# EAGLE design KTS_ver_001 (EAGLE 7.2.0)
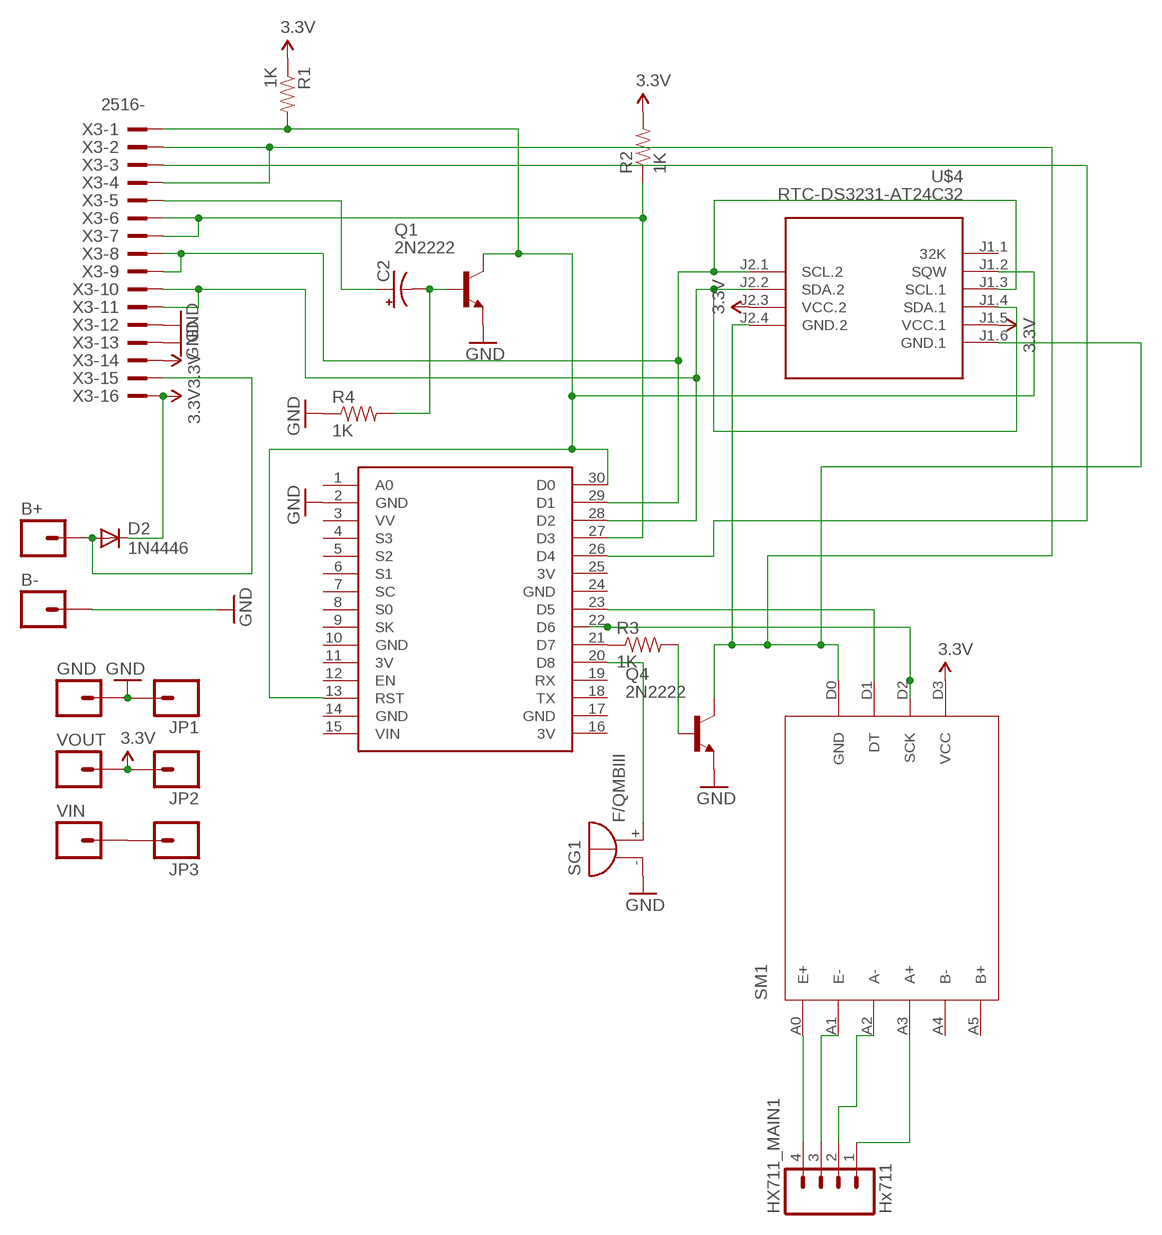
[diagram p0: schematic, sheet 1]

## Parts
B+  M01OFFSET  [1X01_OFFSET]
B-  M01OFFSET  [1X01_OFFSET]
C2  CAP_POLPTH2  [CPOL-RADIAL-10UF-25V]
D2  1N4446  [DO35-10]
GND  M01PTH  [1X01]
HX711_MAIN1  Hx711  M04LOCK  [1X04_LOCK]
JP1  M01PTH  [1X01]
JP2  M01PTH  [1X01]
JP3  M01PTH  [1X01]
Q1  2N2222  [TO18]
Q4  2N2222  [TO18]
R1  1K  1KOHM-1/4W-1%(PTH)  [AXIAL-0.3]
R2  1K  1KOHM-1/4W-1%(PTH)  [AXIAL-0.3]
R3  1K  1KOHM-1/4W-1%(PTH)  [AXIAL-0.3]
R4  1K  1KOHM-1/4W-1%(PTH)  [AXIAL-0.3]
SG1  F/QMBIII  [F/QMBIII]
SM1  HX711  [HX711]
U$3  NODEMCU  [NODEMCU]
U$4  RTC-DS3231-AT24C32  [RTC-DS3231-AT24C32]
VIN  M01PTH  [1X01]
VOUT  M01PTH  [1X01]
X3  2516-  [PAK100/2500-16]

## Nets
3.3V: D2.C JP2.1 R1.P$1 R2.P$2 SM1.D3(VCC) U$4.J1.5(VCC.1) U$4.J2.3(VCC.2) VOUT.1 X3.14 X3.16
BUTTON/D1: U$3.26(D4) X3.3
D7: R3.P$1 U$3.21(D7)
D8/BUZZER1: SG1.+(-) U$3.20(D8)
DS18B20/D1: R2.P$1 U$3.27(D3) X3.6 X3.7
GND: B-.1 GND.1 JP1.1 Q1.1(E) Q4.1(E) R4.P$1 SG1.-(+) U$3.2(GND) X3.12 X3.13
HX711/DT/D5: SM1.D1(DT) U$3.23(D5)
LOADBUS1: Q4.3(C) SM1.D0(GND) U$4.J1.6(GND.1) U$4.J2.4(GND.2) X3.2 X3.4
N$1: B+.1 D2.A X3.15
N$2: C2.2(-) Q1.2(B) R4.P$2
N$4: Q4.2(B) R3.P$2
N$6: JP3.1 VIN.1
N$7: HX711_MAIN1.4 SM1.A0(E+)
N$8: HX711_MAIN1.3 SM1.A1(E-)
N$12: HX711_MAIN1.2 SM1.A2(A-)
N$15: HX711_MAIN1.1 SM1.A3(A+)
RESET_BUS1: Q1.3(C) R1.P$2 U$3.13(RST) U$3.30(D0) U$4.J1.2(SQW) X3.1
SCK/D6/HX711: SM1.D2(SCK) U$3.22(D6)
SCL/D2: U$3.29(D1) U$4.J1.3(SCL.1) U$4.J2.1(SCL.2) X3.8 X3.9
SDA/D1: U$3.28(D2) U$4.J1.4(SDA.1) U$4.J2.2(SDA.2) X3.10 X3.11
SIGNAL(RESET): C2.1(+) X3.5
Unconnected: SM1.A4(B-) SM1.A5(B+) U$3.1(A0) U$3.3(VV) U$3.4(S3) U$3.5(S2) U$3.6(S1) U$3.7(SC) U$3.8(S0) U$3.9(SK) U$3.12(EN) U$3.15(VIN) U$3.18(TX) U$3.19(RX) U$4.J1.1(32K)

## Power pins joined to a net without a drawn wire
3V: U$3.11(3V) U$3.16(3V) U$3.25(3V)
GND: U$3.10(GND) U$3.14(GND) U$3.17(GND) U$3.24(GND)

## Library data of the parts
B+ B- GND JP1-JP3 VIN VOUT = SparkFun-Connectors:M01: Header 1 Standard 1-pin 0.1" header. Use with straight break away headers (SKU : PRT-00116), right angle break away headers (PRT-00553), swiss pins (PRT-00743), machine pins (PRT-00117), and female headers (PRT-00115).
C2 = SparkFun-Capacitors:CAP_POL: Capacitor Polarized These are standard SMD and PTH capacitors. Normally 10uF, 47uF, and 100uF in electrolytic and tantalum varieties. Always verify the external diameter of the through hole cap, it varies with capacity, voltage, and manufacturer. The EIA devices should be standard.
D2 = diode:1N4446: DIODE high speed (Philips)
HX711_MAIN1 = SparkFun-Connectors:M04: Header 4 Standard 4-pin 0.1" header. Use with straight break away headers (SKU : PRT-00116), right angle break away headers (PRT-00553), swiss pins (PRT-00743), machine pins (PRT-00117), and female headers (PRT-00115). Molex polarized connector foot print use with SKU : PRT-08231 with associated crimp pins and housings. 1MM SMD Version SKU: PRT-10208
Q1 Q4 = transistor-npn:2N2222*: NPN Transistor
R1-R4 = SparkFun-Resistors:1KOHM-1/4W-1%(PTH): RES-12182; PROD_ID: RES-12182
SG1 = buzzer:F/QMBIII: BUZZER Source: Buerklin; OC_FARNELL: unknown; OC_NEWARK: unknown
SM1 = hx711:HX711: HX711 module is a Load Cell Amplifier breakout board for the HX711 IC that allows you to easily read load cells to measure weight. This module uses 24 high precision A/D converter chip HX711. It is a specially designed for the high precision electronic scale design, with two analog input channel, the internal integration of 128 times the programmable gain amplifier. The input circuit can be configured to provide a bridge type pressure bridge (such as pressure, weighing sensor mode), is of high precision, low cost is an ideal sampling front-end module.
U$3 = nodemcu (2):NODEMCU
U$4 = diy-modules (1):RTC-DS3231-AT24C32: RTC Module with Battery and EEPROM based on DS3231 and AT24C32 chips Tutorial can be found here: https://edwardmallon.wordpress.com/2014/05/21/using-a-cheap-3-ds3231-rtc-at24c32-eeprom-from-ebay/ Click here to find device on ebay.com <http://www.ebay.com/sch/DS3231+AT24C32+module>
X3 = con-3m:2516-: 3M (TM) Pak 100 4-Wall Header Source: 3M; OC_FARNELL: unknown; OC_NEWARK: unknown

## Board
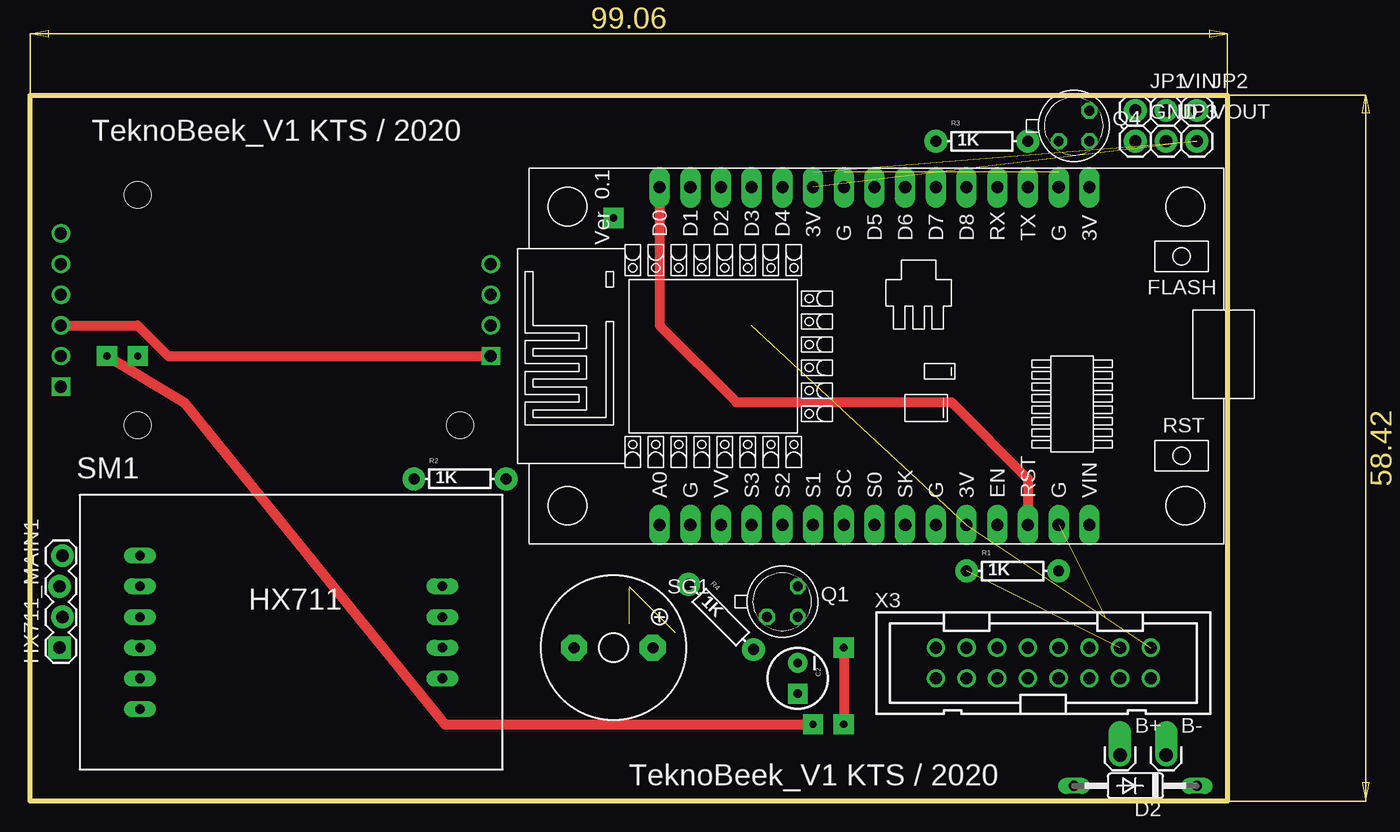
[diagram p1: board, top side]
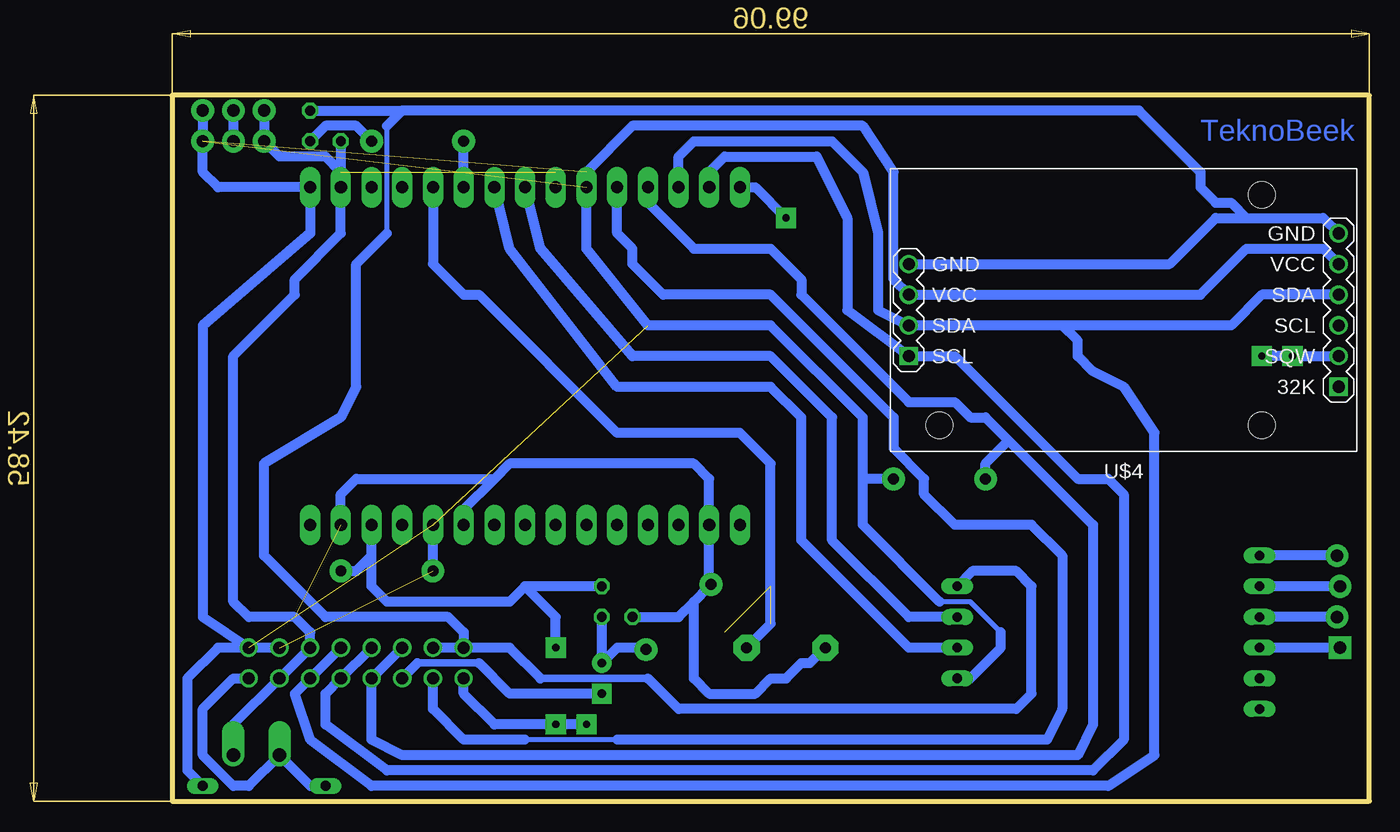
[diagram p2: board, bottom side, seen from below]

Size 99.06 x 58.42 mm. Coordinates in mm from the lower left corner, seen from the top.
Outline: 0,58.42 99.06,58.42 99.06,0 0,0 0,58.42
Copper layers (1*16): Top 0.035mm / dielectric 1.5mm / Bottom 0.035mm
Design rules "default": minimum track width 10mil, minimum drill 24mil, track to track 8mil, track to pad 8mil, pad to pad 8mil, via to via 8mil, smd to smd 8mil, copper to edge 40mil, drill to drill 8mil, minimum pad ring 10mil, minimum via ring 8mil, stop-mask expansion 4mil, vias tented up to drill 0mil, thermal gap 10mil

### Footprints (pad centres in the part's own frame; a part is rotated, then mirrored left to right if it is on the bottom)
1X01_OFFSET = drill 1.118 pad 1.88 offset: 1 0,0
CPOL-RADIAL-10UF-25V = drill 0.7 pad 1.651 square: 1 1.27,0 | drill 0.7 pad 1.651: 2 -1.27,0
DO35-10 = drill 0.813 long: A 5.08,0; C -5.08,0
1X01 = drill 1.016 pad 1.88: 1 0,0
1X04_LOCK = drill 1.016 pad 1.88 square: 1 0,0.127 | drill 1.016 pad 1.88: 2 2.54,-0.127; 3 5.08,0.127; 4 7.62,-0.127
TO18 = drill 0.813 octagon: 1 -1.27,-1.27; 2 1.27,-1.27; 3 1.27,1.27
AXIAL-0.3 = drill 0.9 pad 1.88: P$1 -3.81,0; P$2 3.81,0
F/QMBIII = drill 0.914 pad 2.159 octagon: + 3.251,0; - -3.251,0
HX711 = drill 0.8 long: A0 -12.5,6.35; A1 -12.5,3.81; A2 -12.5,1.27; A3 -12.5,-1.27; A4 -12.5,-3.81; A5 -12.5,-6.35; D0 12.5,3.81; D1 12.5,1.27; D2 12.5,-1.27; D3 12.5,-3.81
NODEMCU = drill 1 pad 1.676 long: 1 -13.97,17.78; 2 -13.97,15.24; 3 -13.97,12.7; 4 -13.97,10.16; 5 -13.97,7.62; 6 -13.97,5.08; 7 -13.97,2.54; 8 -13.97,0; 9 -13.97,-2.54; 10 -13.97,-5.08; 11 -13.97,-7.62; 12 -13.97,-10.16; 13 -13.97,-12.7; 14 -13.97,-15.24; 15 -13.97,-17.78; 16 13.97,-17.78; 17 13.97,-15.24; 18 13.97,-12.7; 19 13.97,-10.16; 20 13.97,-7.62; 21 13.97,-5.08; 22 13.97,-2.54; 23 13.97,0; 24 13.97,2.54; 25 13.97,5.08; 26 13.97,7.62; 27 13.97,10.16; 28 13.97,12.7; 29 13.97,15.24; 30 13.97,17.78
RTC-DS3231-AT24C32 = drill 1 square: J1.1 -17.78,6.35; J2.1 17.78,3.81 | drill 1: J1.2 -17.78,3.81; J1.3 -17.78,1.27; J1.4 -17.78,-1.27; J1.5 -17.78,-3.81; J1.6 -17.78,-6.35; J2.2 17.78,1.27; J2.3 17.78,-1.27; J2.4 17.78,-3.81 | hole 2.2: -11.43,-9.525; -11.43,9.525; 15.24,9.525
PAK100/2500-16 = drill 1 pad 1.422: 1 -8.89,-1.27; 2 -8.89,1.27; 3 -6.35,-1.27; 4 -6.35,1.27; 5 -3.81,-1.27; 6 -3.81,1.27; 7 -1.27,-1.27; 8 -1.27,1.27; 9 1.27,-1.27; 10 1.27,1.27; 11 3.81,-1.27; 12 3.81,1.27; 13 6.35,-1.27; 14 6.35,1.27; 15 8.89,-1.27; 16 8.89,1.27

### Placement (x,y rotation side)
B+  90.17,3.81 0 top
B-  93.98,3.81 0 top
C2  63.5,10.16 270 top
D2  91.44,1.27 180 top
GND  91.44,54.61 0 top
HX711_MAIN1  2.54,12.7 90 top
JP1  91.44,57.15 0 top
JP2  96.52,57.15 0 top
JP3  93.98,54.61 0 top
Q1  62.23,16.51 0 top
Q4  86.36,55.88 0 top
R1  81.28,19.05 0 top
R2  35.56,26.67 0 top
R3  78.74,54.61 0 top
R4  57.15,15.24 315 top
SG1  48.26,12.7 0 top
SM1  21.59,13.97 0 top
U$3  69.85,36.83 90 top
U$4  20.32,40.64 180 bottom
VIN  93.98,57.15 0 top
VOUT  96.52,54.61 0 top
X3  83.82,11.43 0 top

### Tracks (layer width: path | path; a pad name or v marks a point on that pad's centre or on a via)
3.3V  (3 unrouted)
  Bottom 0.406: 30.48,13.97 33.02,16.51 35.56,16.51
  Bottom 0.813: X3.14 X3.16 95.25,12.7 97.79,10.16 97.79,2.54 D2.C | SM1.D3 33.02,10.16 30.48,12.7 30.48,13.97 | 35.56,16.51 41.91,22.86 41.91,26.67 | 41.91,26.67 41.91,31.75 49.53,39.37 59.69,39.37 64.77,45.72 64.77,52.07 60.96,55.88 41.91,55.88 39.37,52.07 39.37,43.18 U$4.J2.3 13.97,41.91 10.16,45.72 3.81,45.72 U$4.J1.5 | R2.P$2 41.91,26.67 | R1.P$1 77.47,22.86 | JP2.1 VOUT.1
3V  (2 unrouted)
  Bottom 0.813: U$3.25 64.77,49.53 | 92.71,12.7 96.52,15.24 96.52,39.37 87.63,46.99 U$3.16 95.25,50.8 96.52,52.07 96.52,54.61
BUTTON/D1
  Bottom 0.406: 62.23,5.08 69.85,5.08
  Bottom 0.813: U$3.26 62.23,46.99 60.96,45.72 60.96,44.45 58.42,41.91 49.53,41.91 39.37,31.75 39.37,29.21 36.83,26.67 36.83,25.4 34.29,22.86 27.94,22.86 25.4,20.32 25.4,7.62 26.67,5.08 62.23,5.08 | X3.3 77.47,7.62 74.93,5.08 69.85,5.08
D7
  Bottom 0.813: U$3.21 R3.P$1
D8/BUZZER1  (2 unrouted)
  Bottom 0.813: U$3.20 77.47,44.45 74.93,41.91 73.66,41.91 62.23,30.48 52.07,30.48 49.53,27.94 49.53,14.68 SG1.+
DS18B20/D1
  Bottom 0.813: U$3.27 59.69,49.53 55.88,45.72 49.53,45.72 46.99,43.18 46.99,41.91 38.1,33.02 34.29,33.02 33.02,31.75 31.75,31.75 29.84,29.85 | X3.6 X3.7 82.55,5.08 80.01,3.81 24.13,3.81 22.86,6.35 22.86,22.86 29.84,29.85 | R2.P$1 31.75,27.94 29.84,29.85
GND  (2 unrouted)
  Bottom 0.813: 55.88,16.51 55.88,10.16 54.61,8.89 50.8,8.89 49.53,10.16 48.26,10.16 46.99,11.43 46.28,11.43 SG1.- | 55.88,16.51 54.61,17.78 | 54.61,17.78 U$3.2 54.61,26.67 55.88,27.94 71.12,27.94 72.39,26.67 | Q1.1 57.15,15.24 55.88,16.51 | U$3.10 74.93,24.13 72.39,26.67 | U$3.17 85.09,46.99 88.9,43.18 88.9,41.91 93.98,36.83 93.98,16.51 92.71,15.24 88.9,15.24 87.63,13.97 X3.12 X3.13 93.98,6.35 B-.1 | U$3.14 85.09,25.4 83.82,26.67 72.39,26.67 | JP1.1 GND.1 90.17,53.34 86.36,53.34 85.09,52.07 U$3.17 | 67.31,52.07 U$3.24 | Q4.1 U$3.17 | R4.P$1 54.61,17.78
HX711/DT/D5
  Bottom 0.813: SM1.D1 38.1,15.24 44.45,21.59 44.45,31.75 49.53,36.83 60.96,36.83 68.58,45.72 U$3.23
LOADBUS1
  Bottom 0.406: 81.28,46.99 81.28,55.88
  Bottom 0.61: 59.69,10.16 68.58,10.16
  Bottom 0.813: X3.2 X3.4 | U$4.J2.4 16.51,44.45 12.7,48.26 10.16,48.26 | 10.16,48.26 3.81,48.26 U$4.J1.6 | X3.2 74.93,13.97 76.2,15.24 86.36,15.24 91.44,20.32 91.44,27.94 85.09,31.75 83.82,34.29 83.82,44.45 81.28,46.99 | SM1.D0 32.82,19.05 29.21,19.05 27.94,17.78 27.94,8.89 29.21,7.62 57.15,7.62 59.69,10.16 | 81.28,55.88 80.01,57.15 | 10.16,48.26 11.43,49.53 12.7,49.53 13.97,50.8 13.97,52.07 19.05,57.15 80.01,57.15 | 68.58,10.16 71.12,12.7 X3.2 | Q4.3 80.01,57.15
N$1
  Bottom 0.813: D2.A 87.63,1.27 B+.1 92.71,1.27 93.98,1.27 96.52,3.81 96.52,7.62 93.98,10.16 X3.15
N$2
  Bottom 0.406: R4.P$2 59.69,12.55 59.69,12.7
  Bottom 0.813: Q1.2 C2.2 62.23,12.7 59.69,12.7
N$4
  Bottom 0.813: R3.P$2 83.82,55.88 86.36,55.88 Q4.2
N$6
  Bottom 0.813: VIN.1 JP3.1
N$7
  Bottom 0.813: HX711_MAIN1.4 SM1.A0
N$8
  Bottom 0.813: HX711_MAIN1.3 SM1.A1
N$12
  Bottom 0.813: HX711_MAIN1.2 SM1.A2
N$15
  Bottom 0.813: HX711_MAIN1.1 SM1.A3
RESET_BUS1  (via drill 0.6 pad 1.68)
  Top 0.813: v6.35,36.83 12.7,33.02 34.29,6.35 v64.77,6.35 | v67.31,12.7 v67.31,6.35 | U$3.30 52.07,39.37 58.42,33.02 76.2,33.02 82.55,26.67 U$3.13
  Bottom 0.813: Q1.3 69.85,17.78 | 69.85,17.78 71.12,16.51 81.28,16.51 82.55,17.78 82.55,20.32 | 82.55,20.32 U$3.13 | R1.P$2 83.82,19.05 82.55,20.32 | X3.1 74.93,8.89 72.39,6.35 v67.31,6.35 v64.77,6.35 | v67.31,12.7 67.31,15.24 69.85,17.78 | U$4.J1.2 v6.35,36.83 v8.89,36.83 | U$3.30 50.8,50.8 v48.26,48.26
SCK/D6/HX711
  Bottom 0.813: SM1.D2 38.1,12.7 46.99,21.59 46.99,31.75 49.53,34.29 62.23,34.29 71.12,45.72 U$3.22
SCL/D2
  Top 0.813: U$4.J1.3 8.89,39.37 11.43,36.83 U$4.J2.1
  Bottom 0.813: X3.8 X3.9 86.36,8.89 86.36,6.35 81.28,2.54 22.86,2.54 20.32,5.08 20.32,25.4 21.59,26.67 24.13,26.67 34.29,36.83 U$4.J2.1 43.18,40.64 43.18,48.26 45.72,53.34 53.34,53.34 54.61,52.07 U$3.29
SDA/D1
  Bottom 0.813: X3.10 X3.11 88.9,8.89 87.63,5.08 82.55,1.27 21.59,1.27 17.78,3.81 17.78,30.48 20.32,34.29 22.86,35.56 24.13,36.83 24.13,38.1 25.4,39.37 | U$3.28 57.15,53.34 55.88,54.61 44.45,54.61 41.91,52.07 40.64,46.99 40.64,40.64 U$4.J2.2 25.4,39.37 | U$4.J1.4 8.89,41.91 11.43,39.37 25.4,39.37
SIGNAL(RESET)
  Bottom 0.61: 73.66,11.43 78.74,11.43
  Bottom 0.813: C2.1 71.12,8.89 73.66,11.43 | 78.74,11.43 X3.5

### Text on the board
Bottom: TeknoBeek
tPlace: TeknoBeek_V1 KTS / 2020 | TeknoBeek_V1 KTS / 2020